# EAGLE design zxld383-boost-driver-12mm-mk-3-led (EAGLE 6.4)
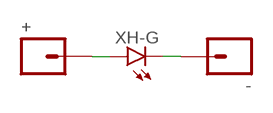
[diagram p0: schematic, sheet 1]

## Parts
+  M01PTH-1.2MM  [1X01-1.2MM]
-  M01PTH-1.2MM-NS  [1X01-1.2MM-NS]
XH-G  LEDXH-G  [CREE-XLAMP-XH-G]

## Nets
GND: -.P$1 XH-G.K(C) XH-G.K@1(C) XH-G.K@2(C) XH-G.K@3(C) XH-G.K@4(C) XH-G.K@5(C) XH-G.K@6(C) XH-G.K@7(C) XH-G.K@8(C)
VCC: +.P$1 XH-G.A

## Library data of the parts
+ - = A_butts:M01: Header 1 Standard 1-pin 0.1" header. Use with straight break away headers (SKU : PRT-00116), right angle break away headers (PRT-00553), swiss pins (PRT-00743), machine pins (PRT-00117), and female headers (PRT-00115).
XH-G = A_butts:LED: LEDs Standard schematic elements and footprints for 5mm, 3mm, 1206, and 0603 sized LEDs. 5mm - Spark Fun Electronics SKU : COM-00529 (and others)

## Board
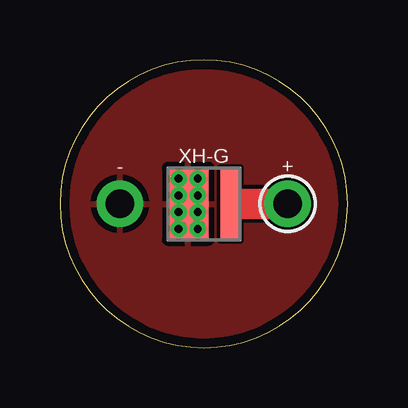
[diagram p1: board, top side]
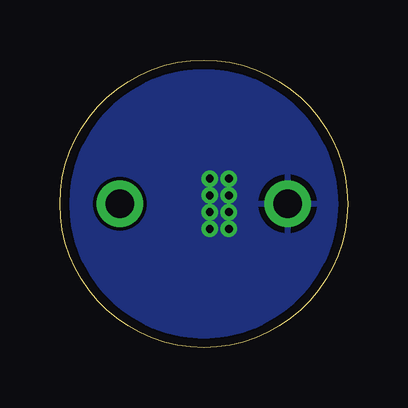
[diagram p2: board, bottom side, seen from below]

Size 12 x 12 mm. Coordinates in mm from the lower left corner, seen from the top.
Outline: 0,6 arc90 6,0 arc90 12,6 arc90 6,12 arc90 0,6
Copper layers (1*16): Top 0.0356mm / dielectric 1.5011mm / Bottom 0.0356mm
Design rules "LaenPCBOrder2": minimum track width 6mil, minimum drill 13mil, track to track 6mil, track to pad 6mil, pad to pad 6mil, via to via 6mil, smd to smd 6mil, copper to edge 15mil, drill to drill 6mil, minimum pad ring 7mil, minimum via ring 7mil, stop-mask expansion 3mil, vias tented up to drill 20mil, thermal gap 10mil

### Footprints (pad centres in the part's own frame; a part is rotated, then mirrored left to right if it is on the bottom)
1X01-1.2MM = drill 1.2 pad 1.93: P$1 0,0
1X01-1.2MM-NS = drill 1.2 pad 1.93: P$1 0,0
CREE-XLAMP-XH-G = smd 0.8 x 3: A 1.1,0 | smd 1.7 x 3: K -0.65,0 | drill 0.33: K@1 -1.05,1.05; K@2 -0.25,1.05; K@3 -0.25,0.35; K@4 -1.05,0.35; K@5 -1.05,-0.35; K@6 -0.25,-0.35; K@7 -1.05,-1.05; K@8 -0.25,-1.05

### Placement (x,y rotation side)
+  9.5,6 0 top
-  2.5,6 0 top
XH-G  6,6 0 top

### Tracks (layer width: path | path; a pad name or v marks a point on that pad's centre or on a via)
GND
  pour Top (rank 6): 6,0 arc-90 0,6 arc-90 6,12 arc-90 12,6 arc-90
  pour Bottom (rank 6): 6,0 arc-90 0,6 arc-90 6,12 arc-90 12,6 arc-90
VCC
  Top 0.406: XH-G.A 7.4,6
  Top 1.27: +.P$1 7.4,6